# Altium schematic sheet externalConnections.SchDoc
size A4; SheetNumber: 3; SheetTotal: 3
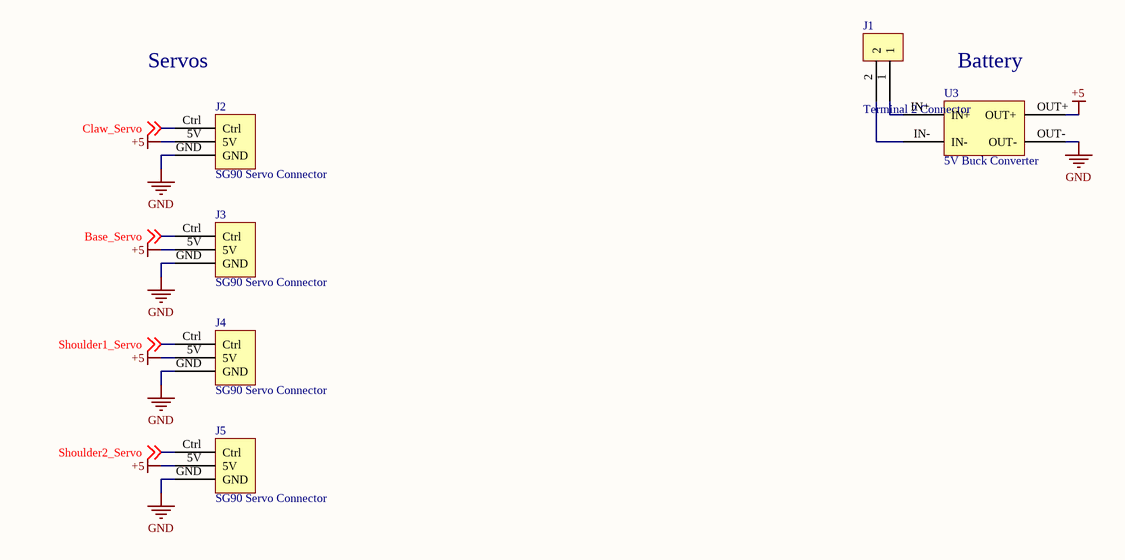
[diagram p0: externalConnections.SchDoc]

## Parts
J1  Terminal 2 Connector  [Terminal 2 Connector]
J2  SG90 Servo Connector  [SG90 Servo Connector]
J3  SG90 Servo Connector  [SG90 Servo Connector]
J4  SG90 Servo Connector  [SG90 Servo Connector]
J5  SG90 Servo Connector  [SG90 Servo Connector]
U3  5V Buck Converter  [5V Buck Converter]

## Nets
+5: J2.5V J3.5V J4.5V J5.5V U3.OUT+
GND: J2.GND J3.GND J4.GND J5.GND U3.OUT-
Base_Servo: J3.Ctrl ; off-sheet Base_Servo
Claw_Servo: J2.Ctrl ; off-sheet Claw_Servo
Shoulder1_Servo: J4.Ctrl ; off-sheet Shoulder1_Servo
Shoulder2_Servo: J5.Ctrl ; off-sheet Shoulder2_Servo
NetJ1_1: J1.1 U3.IN+
NetJ1_2: J1.2 U3.IN-

## Notes on the sheet
- Servos
- (near U3) Battery

## Library data of the parts
J1 = Terminal 2 Connector: https://jlcpcb.com/partdetail/Ningbo_KangnexElec-WJ500V_5_082P/C8465
U3 = 5V Buck Converter: https://www.amazon.ca/Converter-Ajustable-Step-down-Converters-1-25V-35V/dp/B074J4DLWQ/ref=asc_df_B074J4DLWQ/?tag=googleshopc0c-20&linkCode=df0&hvadid=335365451913&hvpos=&hvnetw=g&hvrand=5299524130222726720&hvpone=&hvptwo=&hvqmt=&hvdev=c&hvdvcmdl=&hvlocint=&hvlocphy=9001318&hvtargid=pla-899437512675&psc=1